# EAGLE schematic ioboard (EAGLE 7.5.0)
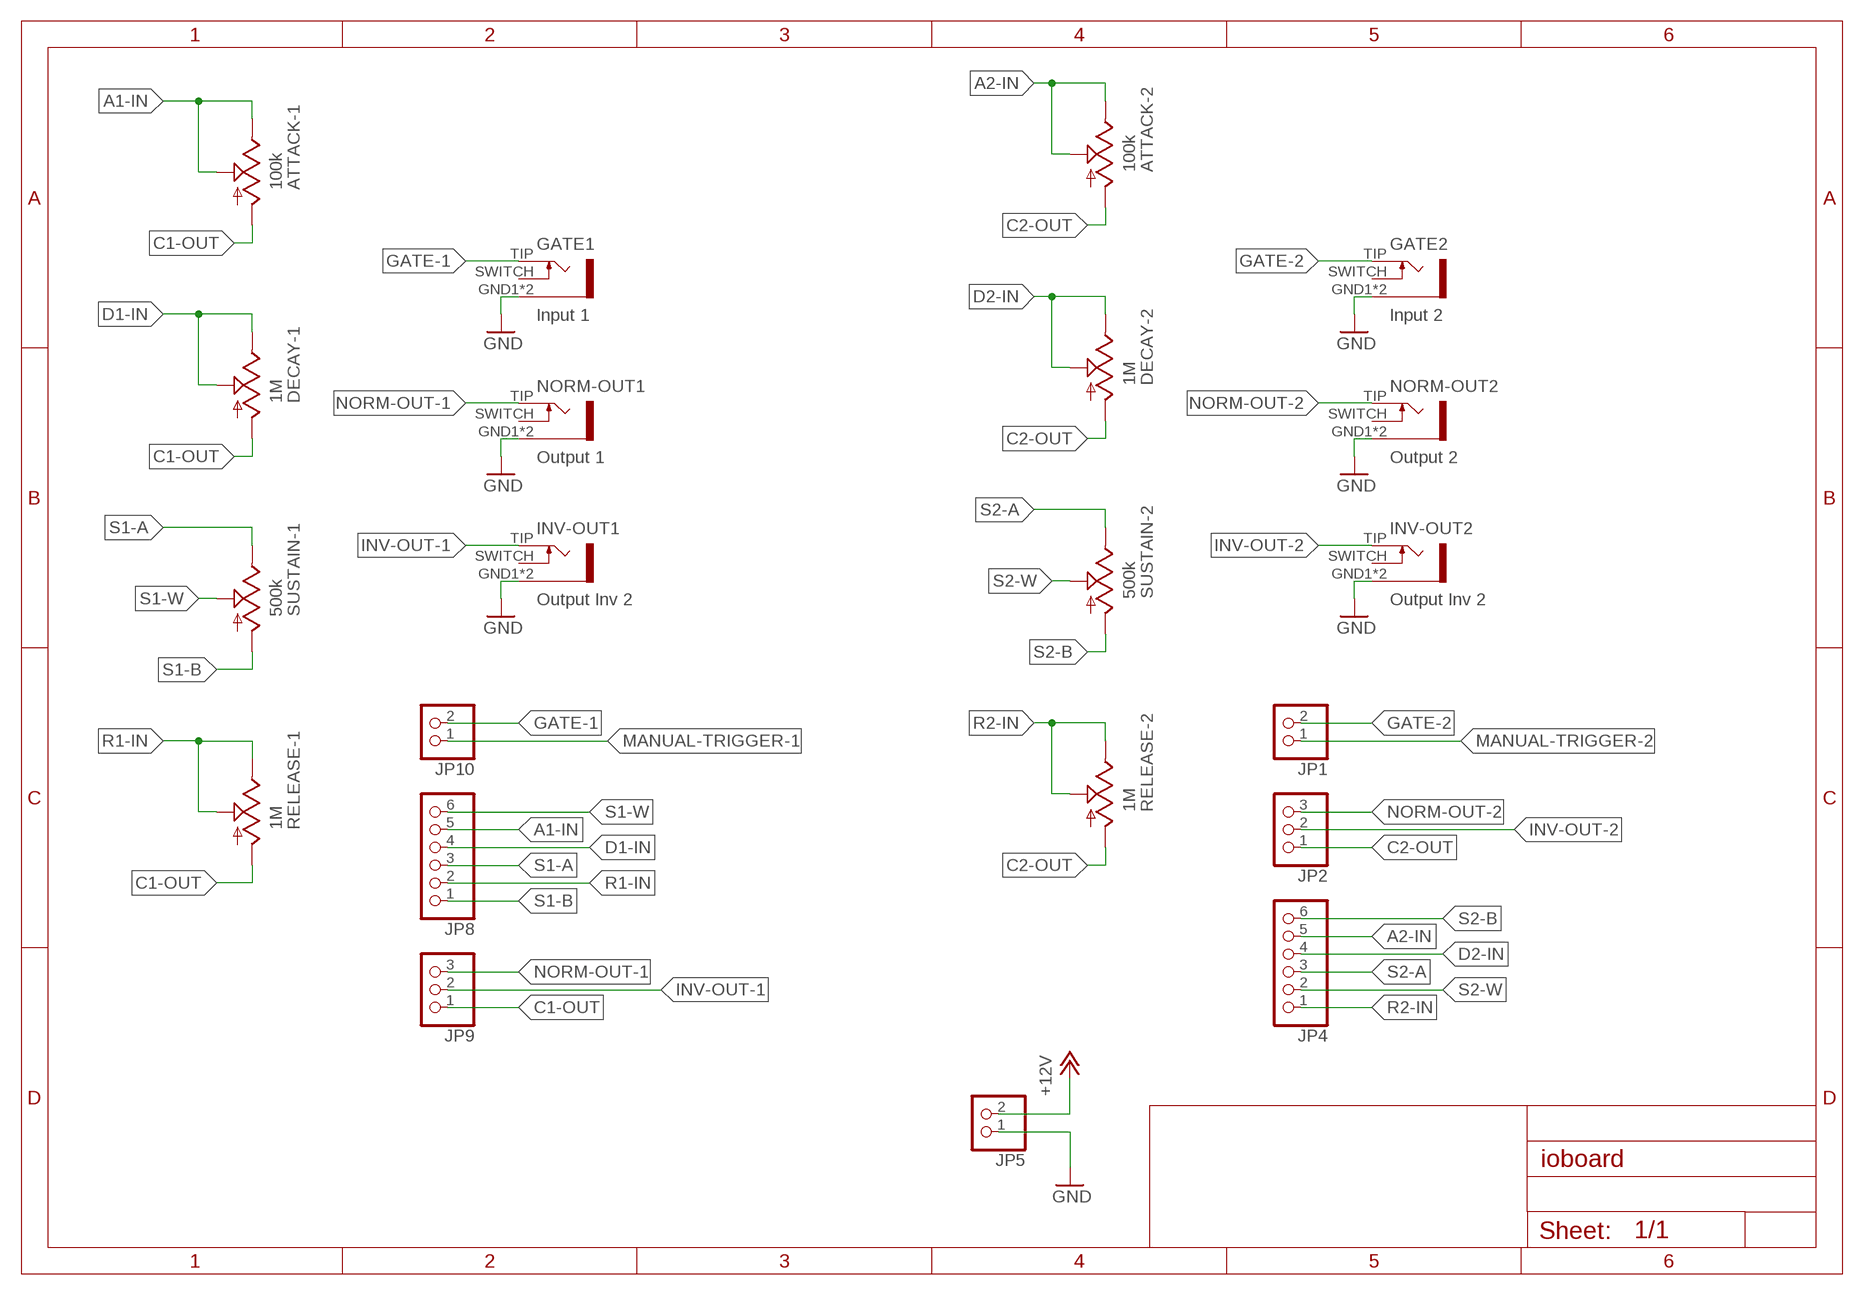
[diagram p0: schematic, sheet 1]

## Parts
ATTACK-1  100k  ALPHA-9MMA  [EVUF]
ATTACK-2  100k  ALPHA-9MMA  [EVUF]
DECAY-1  1M  ALPHA-9MMA  [EVUF]
DECAY-2  1M  ALPHA-9MMA  [EVUF]
GATE1  Input 1  PJ301BMPJ301BM  [PJ301BM]
GATE2  Input 2  PJ301BMPJ301BM  [PJ301BM]
INV-OUT1  Output Inv 2  PJ301BMPJ301BM  [PJ301BM]
INV-OUT2  Output Inv 2  PJ301BMPJ301BM  [PJ301BM]
JP1  PINHD-1X2  [1X02]
JP2  PINHD-1X3  [1X03]
JP4  PINHD-1X6  [1X06]
JP5  PINHD-1X2  [1X02]
JP8  PINHD-1X6  [1X06]
JP9  PINHD-1X3  [1X03]
JP10  PINHD-1X2  [1X02]
NORM-OUT1  Output 1  PJ301BMPJ301BM  [PJ301BM]
NORM-OUT2  Output 2  PJ301BMPJ301BM  [PJ301BM]
RELEASE-1  1M  ALPHA-9MMA  [EVUF]
RELEASE-2  1M  ALPHA-9MMA  [EVUF]
SUSTAIN-1  500k  ALPHA-9MMA  [EVUF]
SUSTAIN-2  500k  ALPHA-9MMA  [EVUF]

## Nets
+12V: JP5.2
A1-IN: ATTACK-1.2(S) ATTACK-1.3(E) JP8.5
A2-IN: ATTACK-2.2(S) ATTACK-2.3(E) JP4.5
C1-OUT: ATTACK-1.1(A) DECAY-1.1(A) JP9.1 RELEASE-1.1(A)
C2-OUT: ATTACK-2.1(A) DECAY-2.1(A) JP2.1 RELEASE-2.1(A)
D1-IN: DECAY-1.2(S) DECAY-1.3(E) JP8.4
D2-IN: DECAY-2.2(S) DECAY-2.3(E) JP4.4
GATE-1: GATE1.TIP JP10.2
GATE-2: GATE2.TIP JP1.2
GND: GATE1.GND1 GATE1.GND2 GATE2.GND1 GATE2.GND2 INV-OUT1.GND1 INV-OUT1.GND2 INV-OUT2.GND1 INV-OUT2.GND2 JP5.1 NORM-OUT1.GND1 NORM-OUT1.GND2 NORM-OUT2.GND1 NORM-OUT2.GND2
INV-OUT-1: INV-OUT1.TIP JP9.2
INV-OUT-2: INV-OUT2.TIP JP2.2
MANUAL-TRIGGER-1: JP10.1
MANUAL-TRIGGER-2: JP1.1
NORM-OUT-1: JP9.3 NORM-OUT1.TIP
NORM-OUT-2: JP2.3 NORM-OUT2.TIP
R1-IN: JP8.2 RELEASE-1.2(S) RELEASE-1.3(E)
R2-IN: JP4.1 RELEASE-2.2(S) RELEASE-2.3(E)
S1-A: JP8.3 SUSTAIN-1.3(E)
S1-B: JP8.1 SUSTAIN-1.1(A)
S1-W: JP8.6 SUSTAIN-1.2(S)
S2-A: JP4.3 SUSTAIN-2.3(E)
S2-B: JP4.6 SUSTAIN-2.1(A)
S2-W: JP4.2 SUSTAIN-2.2(S)
Unconnected: GATE1.SWITCH GATE2.SWITCH INV-OUT1.SWITCH INV-OUT2.SWITCH NORM-OUT1.SWITCH NORM-OUT2.SWITCH

## Library data of the parts
ATTACK-1 ATTACK-2 DECAY-1 DECAY-2 RELEASE-1 RELEASE-2 SUSTAIN-1 SUSTAIN-2 = TomW:ALPHA-9MM: 9 mm Square Rotary Potentiometers Source: Panasonic
GATE1 GATE2 INV-OUT1 INV-OUT2 NORM-OUT1 NORM-OUT2 = gerbster:PJ301BM
JP1 JP5 JP10 = pinhead:PINHD-1X2: PIN HEADER
JP2 JP9 = pinhead:PINHD-1X3: PIN HEADER
JP4 JP8 = pinhead:PINHD-1X6: PIN HEADER